# Altium project PCB_Project1.PrjPCB
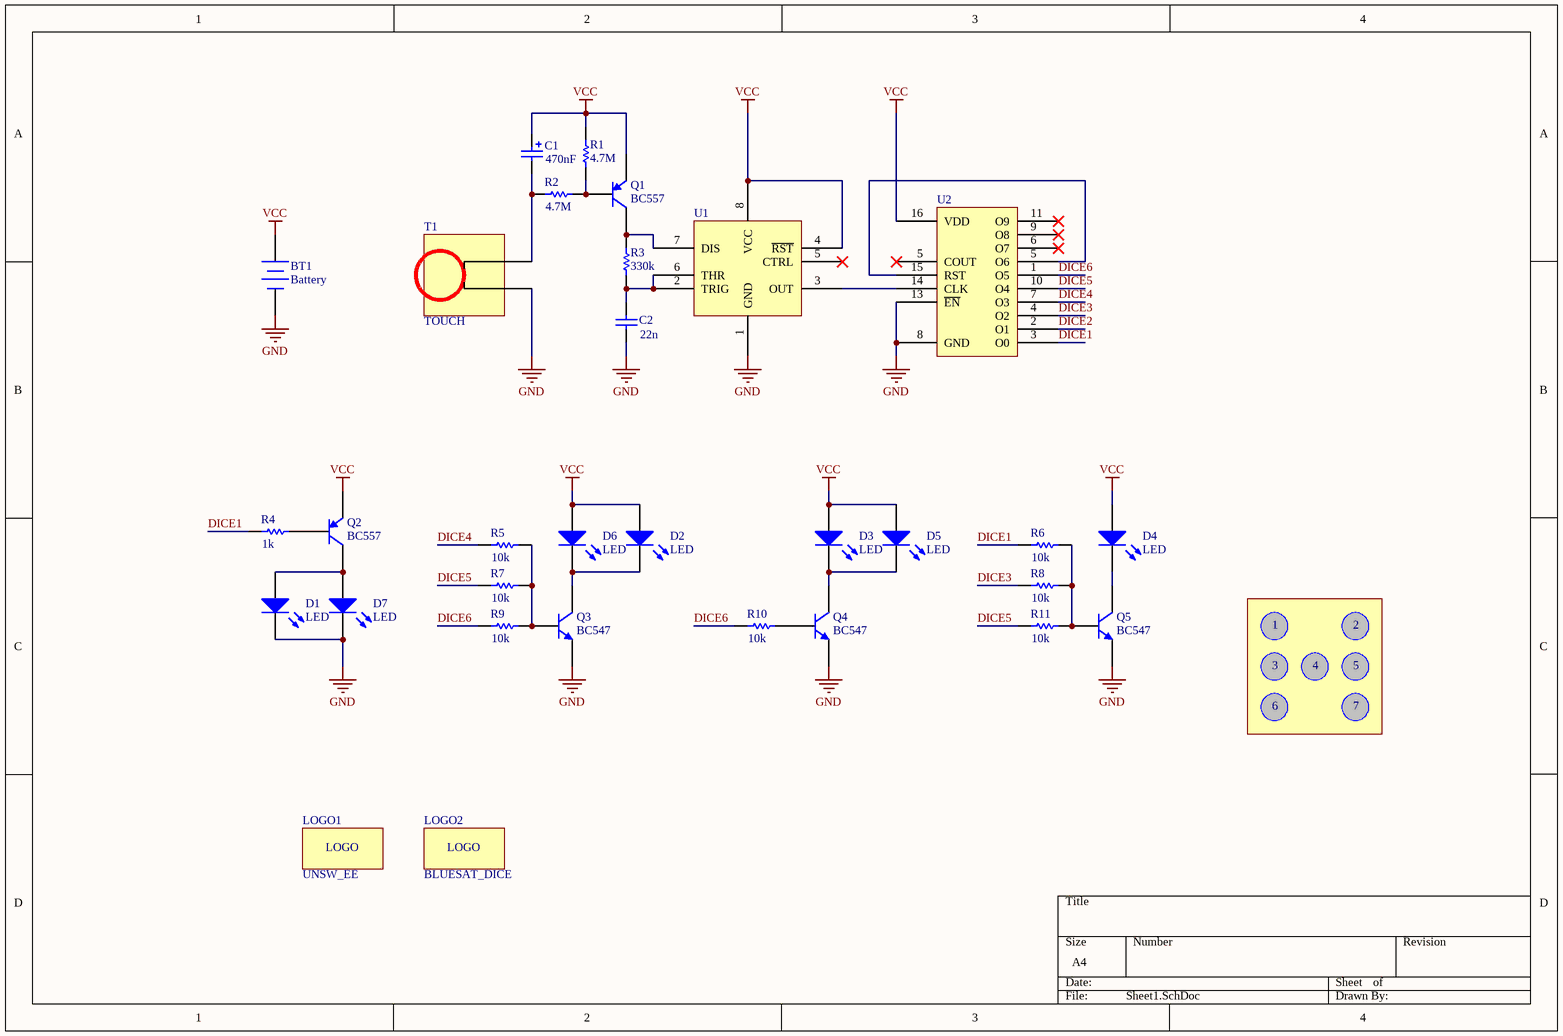
[diagram p0: Sheet1.SchDoc]
1 sheet, 31 parts. Net scope: global (net labels, ports and power ports of the same name join across sheets).
Board file: PCB1.PcbDoc

## Sheet Sheet1.SchDoc
size A4

### Parts
BT1  Battery  [CR2032 CLIP]
C1  value 470nF  [CAPR5-4X5]  (hidden comment: Cap Pol2)
C2  value 22n  [CAPR5-4X5]  (hidden comment: Cap)
D1  LED  [LED]
D2  LED  [LED]
D3  LED  [LED]
D4  LED  [LED]
D5  LED  [LED]
D6  LED  [LED]
D7  LED  [LED]
LOGO1  UNSW_EE  [UNSW_EE]
LOGO2  BLUESAT_DICE  [BLUESAT_DICE]
Q1  BC557  [PNP]
Q2  BC557  [PNP]
Q3  BC547  [NPN]
Q4  BC547  [NPN]
Q5  BC547  [NPN]
R1  value 4.7M  [AXIAL-0.5]  (hidden comment: Res1)
R2  value 4.7M  [AXIAL-0.5]  (hidden comment: Res1)
R3  value 330k  [AXIAL-0.5]  (hidden comment: Res1)
R4  value 1k  [AXIAL-0.5]  (hidden comment: Res1)
R5  value 10k  [AXIAL-0.5]  (hidden comment: Res1)
R6  value 10k  [AXIAL-0.5]  (hidden comment: Res1)
R7  value 10k  [AXIAL-0.5]  (hidden comment: Res1)
R8  value 10k  [AXIAL-0.5]  (hidden comment: Res1)
R9  value 10k  [AXIAL-0.5]  (hidden comment: Res1)
R10  value 10k  [AXIAL-0.5]  (hidden comment: Res1)
R11  value 10k  [AXIAL-0.5]  (hidden comment: Res1)
T1  TOUCH  [PCBComponent_1]
U1  555  [555]  (value not drawn)
U2  CD4017  [CD4017]  (value not drawn)

### Nets
GND: BT1.2(-) C2.1 D1.2(K) D7.2(K) Q3.3(E) Q4.3(E) Q5.3(E) T1.1 U1.1(GND) U2.8(GND) U2.13(~{EN})
VCC: BT1.1(+) C1.1 D2.1(A) D3.1(A) D4.1(A) D5.1(A) D6.1(A) Q1.1(E) Q2.1(E) R1.2 U1.4(~{RST}) U1.8(VCC) U2.16(VDD)
DICE1: R4.1 R6.1 U2.3(O0)
DICE2: U2.2(O1)
DICE3: R8.1 U2.4(O2)
DICE4: R5.1 U2.7(O3)
DICE5: R7.1 R11.1 U2.10(O4)
DICE6: R9.1 R10.1 U2.1(O5)
NetC1_2: C1.2 R2.1 T1.2
NetC2_2: C2.2 R3.1 U1.2(TRIG) U1.6(THR)
NetD1_1: D1.1(A) D7.1(A) Q2.3(C)
NetD2_2: D2.2(K) D6.2(K) Q3.1(C)
NetD3_2: D3.2(K) D5.2(K) Q4.1(C)
NetD4_2: D4.2(K) Q5.1(C)
NetQ1_2: Q1.2(B) R1.1 R2.2
NetQ1_3: Q1.3(C) R3.2 U1.7(DIS)
NetQ2_2: Q2.2(B) R4.2
NetQ3_2: Q3.2(B) R5.2 R7.2 R9.2
NetQ4_2: Q4.2(B) R10.2
NetQ5_2: Q5.2(B) R6.2 R8.2 R11.2
NetU1_3: U1.3(OUT) U2.14(CLK)
NetU2_5: U2.5(O6) U2.15(RST)

Not connected (* = marked no-connect by the designer): U1 5(CTRL)*; U2 6(O7)* 9(O8)* 11(O9)*

### Notes on the sheet
- 1
- 2
- 6
- 3
- 4
- 7
- 5

### Library data of the parts
BT1 = Battery: Multicell Battery; Published: 24-Mar-1999; LatestRevisionDate: 17-Jul-2002; LatestRevisionNote: Re-released for DXP Platform.; PackageReference: BAT-2; Publisher: Altium Limited; PackageDescription: Battery; 2 Leads
C1 = Cap Pol2: Polarized Capacitor (Axial); Published: 8-Jun-2000; LatestRevisionDate: 17-Jul-2002; LatestRevisionNote: Re-released for DXP Platform.; PackageReference: POLAR0.8; Publisher: Altium Limited; PackageDescription: Polarized Capacitor; 2 Leads; Supplier 1: Farnell; Supplier Part Number 1: 1694347
C2 = Cap: Capacitor; Published: 8-Jun-2000; LatestRevisionDate: 17-Jul-2002; LatestRevisionNote: Re-released for DXP Platform.; PackageReference: RAD-0.3; Publisher: Altium Limited; PackageDescription: Radial Cap, Thru-Hole; 2 Leads; 0.3 in Pin Spacing; Supplier 1: Farnell; Supplier Part Number 1: 1694343
D1-D7 = LED0: Typical INFRARED GaAs LED; Published: 8-Jun-2000; LatestRevisionDate: 08-Jul-2005; LatestRevisionNote: Mech Layer 1 removed.; PackageReference: LED-0; Publisher: Altium Limited; PackageDescription: LED; 2 Leads
LOGO1 LOGO2 = LOGO
Q1 Q2 = 2N3906: PNP General Purpose Amplifier; Published: 8-Jun-2000; LatestRevisionDate: 15-Jan-2003; LatestRevisionNote: PCB Footprint 'BCY-W3/D4.7' replaced; DatasheetVersion: 1997; PackageVersion: Sep-1998; PackageReference: TO-92A; Publisher: Altium Limited; PackageDescription: TO, Flat Index; 3 In-Line, Axial Leads; Body Dia. 4.5mm; Leads 0.51 x 0.48 mm (max); ComponentLink1Description: Manufacturer Link; ComponentLink1URL: http://www.fairchildsemi.com/; ComponentLink2Description: Datasheet; ComponentLink2URL: http://www.fairchildsemi.com/ds/2N%2F2N3906.pdf
Q3-Q5 = NPN: NPN Bipolar Transistor; Published: 8-Jun-2000; LatestRevisionDate: 17-Jul-2002; LatestRevisionNote: Re-released for DXP Platform.; PackageReference: TO-226-AA; Publisher: Altium Limited; PackageDescription: TO, Flat Index; 3 In-Line, Axial Leads; Body Dia. 4.8mm; Leads 0.55 x 0.51 mm (max); Code_JEDEC: TO-226-AA
R1-R11 = Res1: Resistor; Published: 8-Jun-2000; LatestRevisionDate: 17-Jul-2002; LatestRevisionNote: Re-released for DXP Platform.; PackageReference: AXIAL-0.3; Publisher: Altium Limited; PackageDescription: Axial Device, Thru-Hole; 2 Leads; 0.3 in Pin Spacing